# Altium schematic sheet 12-POWER-P12V.SchDoc
size A3; Customer: 01910; SPICEModelCache: <root> / <DocumentId>GNEMVTBT</DocumentId> / </root>; SheetNumber: 11; SheetTotal: 15
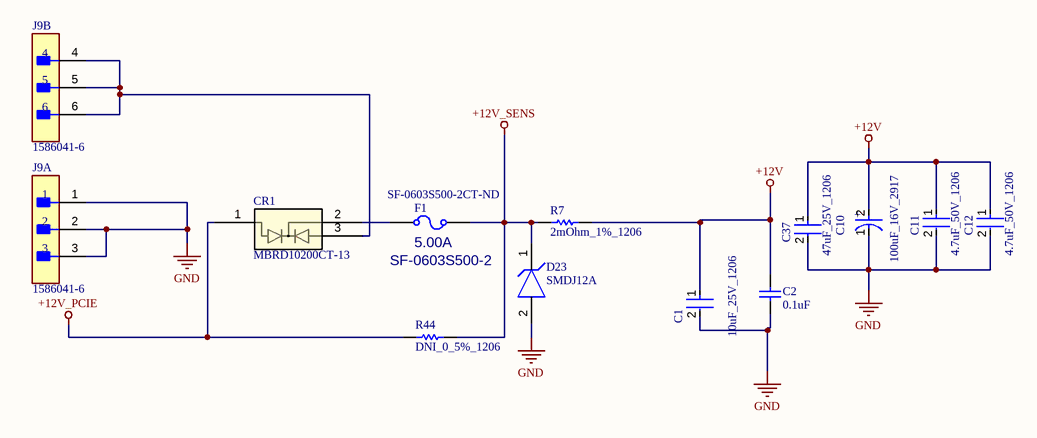
[diagram p0: 12-POWER-P12V.SchDoc]

## Parts
C1  10uF_25V_1206  [FP-MK316L-MFG]
C2  0.1uF  [CAPC1608X87X45ML20T05]
C10  100uF_16V_2917  [FP-T495D107K016ATE125-MFG]
C11  4.7uF_50V_1206  [FP-GRM31C-0_2-e0_3_0_8-IPC_C]
C12  4.7uF_50V_1206  [FP-GRM31C-0_2-e0_3_0_8-IPC_C]
C37  47uF_25V_1206  [FP-C3216-160-0_2-MFG]
CR1  MBRD10200CT-13  [TO252(DPAK)_DIO]
D23  SMDJ12A  [FP-DO-214AB_SMC_J-Bend-MFG]
F1  value 5.00A  MFG PART NUM: SF-0603S500-2  Supplier Part Number 1: SF-0603S500-2CT-ND  [FUSM1608X60N]  (hidden comment: FUSE_0603_5.00A)
J9  1586041-6  [FP-1586041-6-MFG]  (parts A,B of 2)
R7  2mOhm_1%_1206  [RESC3216X89X64NL25T25]
R44  DNI_0_5%_1206  [RESC3116X65X50ML20T20]  (no BOM)

## Nets
+12V: C1.1 C2.2 C10.2(A) C11.1 C12.1 C37.1 R7.2
+12V_PCIE: CR1.1 R44.1
+12V_SENS: D23.1(C) F1.2 R7.1 R44.2
GND: C1.2 C2.1 C10.1(C) C11.2 C12.2 C37.2 D23.2(A) J9.1 J9.2 J9.3
NetCR1_2: CR1.2 F1.1
NetCR1_3: CR1.3 J9.4 J9.5 J9.6

## Notes on the sheet
- SHEET
- REV
- timingcard.com <http://timingcard.com>
- DATE
- OF
- (in symbol CMP-2000-07207-2) +

## Library data of the parts
C1 = CMP-2000-07261-2: CAP CER 10UF 25V X7R 1206; Tolerance: 10%; Number of Pins: 2; Voltage Rating (DC): 25V; Case Code (Imperial): 1206; Termination: SMD/SMT; Case/Package: 1206; Capacitance: 10uF; Dielectric: X7R; Thickness: 0.071inch; Series: M; Weight: 0.000571oz; Mount: Surface Mount; RoHS Compliant: Yes; Min Operating Temperature: -55°C; Resistor Type: Ceramic; Length: 0.126inch; Package Quantity: 1; Height: 1.6mm; Construction: Flat; Case Code (Metric): 3216; Voltage Rating: 25V; Packaging: Tape and Reel; Max Operating Temperature: 125°C; Width: 1.6mm
C2 = CMP-2006-00003-1: C0603X104K5RACAUTO; Manufacturer: Kemet; Part Number: C0603X104K5RACAUTO
C10 = CMP-2000-07207-2: CAP TANT 100UF 10% 16V 2917; Life (Hours): 2000Hour; ESR (Equivalent Series Resistance): 125mR; Polarity: Polar; Dielectric Material: Tantalum; Dissipation Factor: 8%; Capacitance: 100uF; Radiation Hardening: No; RoHS Compliant: Yes; Length: 7.3mm; Features: General Purpose; Packaging: Tape and Reel; Package Quantity: 1; Weight: 0.023634oz; Voltage Rating: 16V; Width: 0.169inch; Case/Package: 2917; Mount: Surface Mount; Voltage: 16V; Min Operating Temperature: -55°C; Tolerance: 10%; REACH SVHC: No SVHC; Height - Seated (Max): 0.122inch; Number of Pins: 2; Construction: Flat; Depth: 4.3mm; Series: T495; Max Operating Temperature: 125°C; Failure Rate: 0.001%; Termination: SMD/SMT; Voltage Rating (DC): 16V; Case Code (Imperial): 2917; Case Code (Metric): 7343; Height: 2.8mm
C11 C12 = CMP-1037-04923-3: Chip Multilayer Ceramic Capacitors for General Purpose, 1206, 4.7uF, X7R, 15%, 10%, 50V; Height: 1.6mm; Voltage: 50V; Capacitance: 4.7uF; Lead Free: Lead Free; Max Operating Temperature: 125°C; Packaging: Tape and Reel; REACH SVHC: No SVHC; Voltage Rating: 50V; Mount: Surface Mount; Termination: SMD/SMT; Tolerance: 10%; Case/Package: 1206; Material: Ceramic; Depth: 1.6mm; Length: 3.2mm; Case Code (Metric): 3216; Voltage Rating (DC): 50V; Case Code (Imperial): 1206; Radiation Hardening: No; Width: 0.063inch; Thickness: 0.071inch; Package Quantity: 2000; Min Operating Temperature: -55°C; Dielectric: X7R
C37 = CMP-2000-05397-3: Multilayer Ceramic Capacitors 47uF ±20% 25V X5R SMD 1206; Weight: 0.000571oz; Dielectric: X5R; Length: 0.126inch; Voltage Rating: 25V; Case/Package: 1206; Dielectric Material: Ceramic; Min Operating Temperature: -55°C; Lead Free: Lead Free; Packaging: Tape and Reel; Package Quantity: 1; Mount: Surface Mount; Depth: 1.6mm; REACH SVHC: No SVHC; Termination: SMD/SMT; Case Code (Imperial): 1206; Series: C; Resistor Type: Ceramic; Voltage: 25V; Width: 0.063inch; Height: 1.6mm; Tolerance: 20%; Capacitance: 47uF; Max Operating Temperature: 85°C; Voltage Rating (DC): 25V; RoHS Compliant: Yes; Thickness: 0.071inch; Case Code (Metric): 3216
CR1 = MBRD10200CT-13: No Description Available; Mfr_Name: Diodes Inc; Type: Diodes - Rectifiers, Arrays; RefDes: RefDes
D23 = CMP-08607-000111-1: TVS DIODE 12V 19.9V DO214AB; Number of Channels: 1; Power Line Protection: No; Reverse Breakdown Voltage: 13.3V; Max Power Dissipation: 6.5W; Peak Pulse Current: 150.8A; Leakage Current: 2uA; Diode Type: ZENER; Power Dissipation: 3kW; Test Current: 1mA; Direction: Unidirectional; Max Breakdown Voltage: 14.7V; Lead Free: Lead Free; Packaging: Tape and Reel; Series: SMDJ; Number of Pins: 2; Resistor Type: Zener; Termination: SMD/SMT; RoHS Compliant: Yes; Number of Elements: 1; REACH SVHC: No SVHC; Min Breakdown Voltage: 13.3V; Mount: Surface Mount; Operating Supply Voltage: 12V; Polarity: Unidirectional; Breakdown Voltage: 13.3V; Max Surge Current: 150.8A; Clamping Voltage-Max: 19.9V; Clamping Voltage: 19.9V; Reverse Standoff Voltage: 12V; Max Operating Temperature: 150°C; Case/Package: DO-214AB; Package Quantity: 3000; Peak Pulse Power: 3kW; Min Operating Temperature: -55°C; Number of Unidirectional Channels: 1
F1 = FUSE_0603_2.00A: FUSE SLOW 5.00A 32V M 0603; VALENTIUM PART NUM: <VALENTIUM>; MFG NAME: BOURNS; MAXTEMP: 105C; MINTEMP: -40C; OTHER: UL E141069; P1: SLOW BLO; DESC: FUSE SLOW 1.25A 32V M 0603; MODIFY DATE: 9/4/2013; CATEGORY: FUSE; DATE: 20 OCT 15; P2: 32V; P3: M; SIZE: 0603; SHEETPART: *; Supplier 1: Digi-Key
J9 = CMP-03369-000060-1: CONN HEADER R/A 6POS 4.2MM; Manufacturer: TE; Current Rating: 9A; Conn Orientation: Right Angle; Voltage Rating: 600V; Conn Gender: Male; Number Of Contacts: 6; Standoff Height: 0.4mm; Digikey Description: CONN HEADER R/A 6POS 4.2MM; Manufacturer Part Number: 1586041-6; Temperature: -40°C to +105°C; Device Class L1: Connectors; Temperature Range High: +105°C; RoHS: TRUE; Device Class L2: Headers and Wire Housings; Package: 1586041-6; Number Of Rows: 2; ComponentLink2Description: Datasheet; ComponentLink2URL: https://www.te.com/commerce/DocumentDelivery/DDEController?Action=showdoc&DocId=Specification+Or+Standard%7F108-2112%7FD2%7Fpdf%7FEnglish%7FENG_SS_108-2112_D2.pdf%7F1586041-6; Temperature Range Low: -40°C; Footprint Url: https://www.te.com/commerce/DocumentDelivery/DDEController?Action=showdoc&DocId=Customer+Drawing%7F1586041%7FB5%7Fpdf%7FEnglish%7FENG_CD_1586041_B5.pdf%7F1586041-6; Device Class L3: unset; Contact Material: Tin,Nickel; Octopart: https://octopart.com/1586041-6-te+connectivity-46514050; Category: Conn; Lead Free: Yes; Pitch: 4.2mm; Mouser Description: Conn Power HDR 6 POS 4.2mm Solder RA Thru-Hole 6 Terminal 1 Port Tray; Height: 11.95mm; Automotive: No
R7 = CMP-2003-04334-1: Manufacturer: Vishay Dale; Part Number: WSL12062L000FEA18
R44 = CMP-2003-04873-1: Part Number: CRCW12060000Z0EAHP; Manufacturer: Vishay Dale